# EAGLE schematic Blocky_Uno (EAGLE 9.1.3)
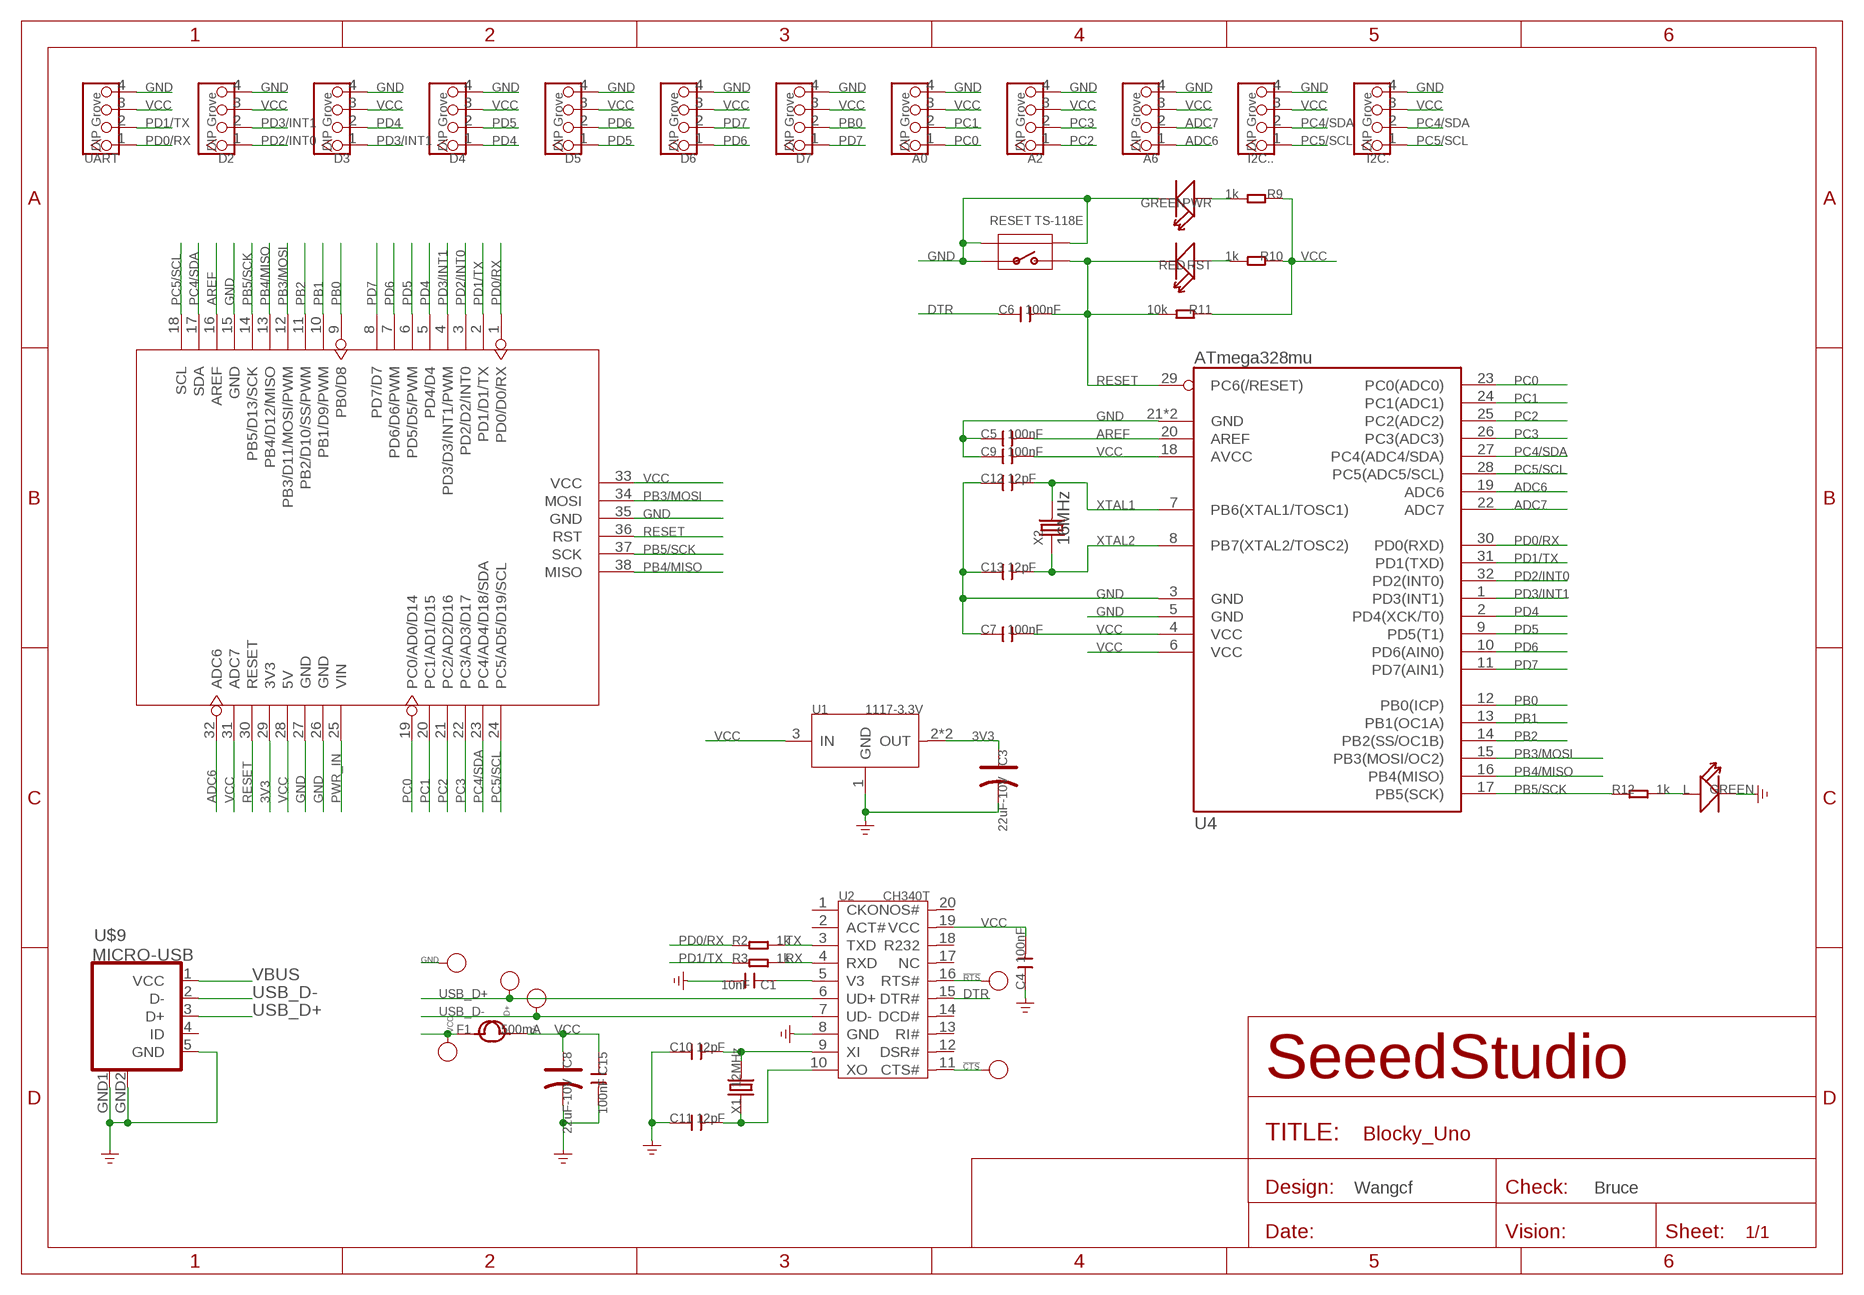
[diagram p0: schematic, sheet 1]

## Parts
!CTS  PAD-TEST-POINT'4545'  [TP_4545]
!RTS  PAD-TEST-POINT'4545'  [TP_4545]
A0  DIP Grove  TWIG-4P-2.0-2.0  [4P-2.0]
A2  DIP Grove  TWIG-4P-2.0-2.0  [4P-2.0]
A6  DIP Grove  TWIG-4P-2.0-2.0  [4P-2.0]
C1  10nF  C-0603  [C0603]
C3  22uF-10V  CAP-AVX-A  [AVX-A]
C4  100nF  C-0603  [C0603]
C5  100nF  C-0603  [C0603]
C6  100nF  C-0603  [C0603]
C7  100nF  C-0603  [C0603]
C8  22uF-10V  CAP-AVX-A  [AVX-A]
C9  100nF  C-0603  [C0603]
C10  12pF  C-0603  [C0603]
C11  12pF  C-0603  [C0603]
C12  12pF  C-0603  [C0603]
C13  12pF  C-0603  [C0603]
C15  100nF  C-0603  [C0603]
D2  DIP Grove  TWIG-4P-2.0-2.0  [4P-2.0]
D3  DIP Grove  TWIG-4P-2.0-2.0  [4P-2.0]
D4  DIP Grove  TWIG-4P-2.0-2.0  [4P-2.0]
D5  DIP Grove  TWIG-4P-2.0-2.0  [4P-2.0]
D6  DIP Grove  TWIG-4P-2.0-2.0  [4P-2.0]
D7  DIP Grove  TWIG-4P-2.0-2.0  [4P-2.0]
D+  PAD-TEST-POINT'4545'  [TP_4545]
D-  PAD-TEST-POINT'4545'  [TP_4545]
F1  500mA  FUSE'1206'  [F1206]
GND  PAD-TEST-POINT'4545'  [TP_4545]
I2C.  DIP Grove  TWIG-4P-2.0-2.0  [4P-2.0]
I2C..  DIP Grove  TWIG-4P-2.0-2.0  [4P-2.0]
L  GREEN  LED'0603'  [LED-0603]
PWR  GREEN  LED'0603'  [LED-0603]
R2  1k  R-0603  [R0603]
R3  1k  R-0603  [R0603]
R9  1k  R-0603  [R0603]
R10  1k  R-0603  [R0603]
R11  10k  R-0603  [R0603]
R12  1k  R-0603  [R0603]
RESET  TS-118E  BUTTON-4P-REINFORCE'TS-1188E'  [4P-SMD-7X3.5X3.5H]
RST  RED  LED'0603'  [LED-0603]
U1  1117-3.3V  LD1117'SOT89'  [SOT89]
U2  CH340T  [SSOP20]
U3  ARDUINO-38P  [ARDUINO-38P]
U4  ATmega328mu  ATMEGA8/168/328MLF  [MLF32X-W/HEAT]
U$9  MICRO-USB  [MICRO-USB]
UART  DIP Grove  TWIG-4P-2.0-2.0  [4P-2.0]
VCC  PAD-TEST-POINT'4545'  [TP_4545]
X1  12MHz  CRYSTAL'5032'  [2P-SMD-5X3.2]
X2  16MHz  CRYSTAL'5032'  [2P-SMD-5X3.2]

## Nets
3V3: C3.+ U1.2(OUT) U1.4(OUT) U3.29(3V3)
ADC6: A6.1 U3.32(ADC6) U4.19(ADC6)
ADC7: A6.2 U4.22(ADC7)
AREF: C5.2 U3.16(AREF) U4.20(AREF)
CTS: !CTS.T U2.11(CTS#)
DTR: C6.1 U2.15(DTR#)
GND: A0.4 A2.4 A6.4 C1.2 C3.- C4.1 C5.1 C7.1 C8.- C9.1 C10.1 C11.1 C12.1 C13.1 C15.2 D2.4 D3.4 D4.4 D5.4 D6.4 D7.4 GND.T I2C..4 I2C...4 L.- PWR.- RESET.1 RESET.S1 RESET.S2 U1.1(GND) U2.8(GND) U3.15(GND) U3.26(GND) U3.27(GND) U3.35(GND) U4.3(GND) U4.5(GND) U4.21(GND) U4.HEAT(GND) U$9.5(GND) U$9.GND1(GND) U$9.GND2(GND) UART.4
N$2: R10.2 RST.+
N$3: PWR.+ R9.2
N$4: C10.2 U2.9(XI) X1.2
N$5: C11.2 U2.10(XO) X1.1
N$11: !RTS.T U2.16(RTS#)
N$13: L.+ R12.2
PB0: D7.2 U3.9(PB0/D8) U4.12(PB0(ICP))
PB1: U3.10(PB1/D9/PWM) U4.13(PB1(OC1A))
PB2: U3.11(PB2/D10/SS/PWM) U4.14(PB2(SS/OC1B))
PB3/MOSI: U3.12(PB3/D11/MOSI/PWM) U3.34(MOSI) U4.15(PB3(MOSI/OC2))
PB4/MISO: U3.13(PB4/D12/MISO) U3.38(MISO) U4.16(PB4(MISO))
PB5/SCK: R12.1 U3.14(PB5/D13/SCK) U3.37(SCK) U4.17(PB5(SCK))
PC0: A0.1 U3.19(PC0/AD0/D14) U4.23(PC0(ADC0))
PC1: A0.2 U3.20(PC1/AD1/D15) U4.24(PC1(ADC1))
PC2: A2.1 U3.21(PC2/AD2/D16) U4.25(PC2(ADC2))
PC3: A2.2 U3.22(PC3/AD3/D17) U4.26(PC3(ADC3))
PC4/SDA: I2C..2 I2C...2 U3.17(SDA) U3.23(PC4/AD4/D18/SDA) U4.27(PC4(ADC4/SDA))
PC5/SCL: I2C..1 I2C...1 U3.18(SCL) U3.24(PC5/AD5/D19/SCL) U4.28(PC5(ADC5/SCL))
PD0/RX: R2.1 U3.1(PD0/D0/RX) U4.30(PD0(RXD)) UART.1
PD1/TX: R3.1 U3.2(PD1/D1/TX) U4.31(PD1(TXD)) UART.2
PD2/INT0: D2.1 U3.3(PD2/D2/INT0) U4.32(PD2(INT0))
PD3/INT1: D2.2 D3.1 U3.4(PD3/D3/INT1/PWM) U4.1(PD3(INT1))
PD4: D3.2 D4.1 U3.5(PD4/D4) U4.2(PD4(XCK/T0))
PD5: D4.2 D5.1 U3.6(PD5/D5/PWM) U4.9(PD5(T1))
PD6: D5.2 D6.1 U3.7(PD6/D6/PWM) U4.10(PD6(AIN0))
PD7: D6.2 D7.1 U3.8(PD7/D7) U4.11(PD7(AIN1))
PWR_IN: U3.25(VIN)
RESET: C6.2 R11.2 RESET.2 RST.- U3.30(RESET) U3.36(RST) U4.29(PC6(/RESET))
RX: R3.2 U2.4(RXD)
TX: R2.2 U2.3(TXD)
USB_D+: D+.T U2.6(UD+) U$9.3(D+)
USB_D-: D-.T U2.7(UD-) U$9.2(D-)
V3: C1.1 U2.5(V3)
VBUS [usbvcc]: F1.1 U$9.1(VCC) VCC.T
VCC: A0.3 A2.3 A6.3 C4.2 C7.2 C8.+ C9.2 C15.1 D2.3 D3.3 D4.3 D5.3 D6.3 D7.3 F1.2 I2C..3 I2C...3 R9.1 R10.1 R11.1 U1.3(IN) U2.19(VCC) U3.28(5V) U3.31(ADC7) U3.33(VCC) U4.4(VCC) U4.6(VCC) U4.18(AVCC) UART.3
XTAL1: C12.2 U4.7(PB6(XTAL1/TOSC1)) X2.2
XTAL2: C13.2 U4.8(PB7(XTAL2/TOSC2)) X2.1
Unconnected: U2.1(CKO) U2.2(ACT#) U2.12(DSR#) U2.13(RI#) U2.14(DCD#) U2.17(NC) U2.18(R232) U2.20(NOS#) U$9.4(ID)

## Notes on the sheet
- Wangcf | Bruce

## Library data of the parts
!CTS !RTS D+ D- GND VCC = Discrete:PAD-TEST-POINT; PARTNO: DNP
A0 A2 A6 = Connector :TWIG-4P-2.0
C1 C4-C7 C9-C13 C15 = Discrete:C*: Ceramic Capacitors
C3 C8 = Discrete:CAP*: Electrolytic Capacitors,Tantalum Capacitors and Super Capacitors
D2-D7 I2C. I2C.. UART = Connector:TWIG-4P-2.0
F1 = Discrete:FUSE
L PWR RST = Discrete:LED*
R2 R3 R9-R12 = Discrete:R*
RESET = Discrete:BUTTON-4P-REINFORCE: TS-1188E http://www.best-dz.com/?thread-374-2.html
U1 = IC:LD1117: Low Drop Fixed And Adjustable Positive Voltage Regulators http://www.datasheetcatalog.org/datasheet/SGSThomsonMicroelectronics/mXuqtqv.pdf
U2 = template:CH340T
U3 = moudle:ARDUINO-38P
U4 = IC:ATMEGA8/168/328: MICROCONTROLLER
U$9 = My-Eagle-Lib:MICRO-USB: Micro USB B connector
X1 X2 = Discrete:CRYSTAL*: CRYSTAL

## Net classes
0 default: width 0.152 mm, drill 0.305 mm, clearance 0.152 mm
3 usbvcc: width 0.203 mm, drill 0.305 mm, clearance 0.203 mm